# EAGLE design implant8 (EAGLE 7.6.0)
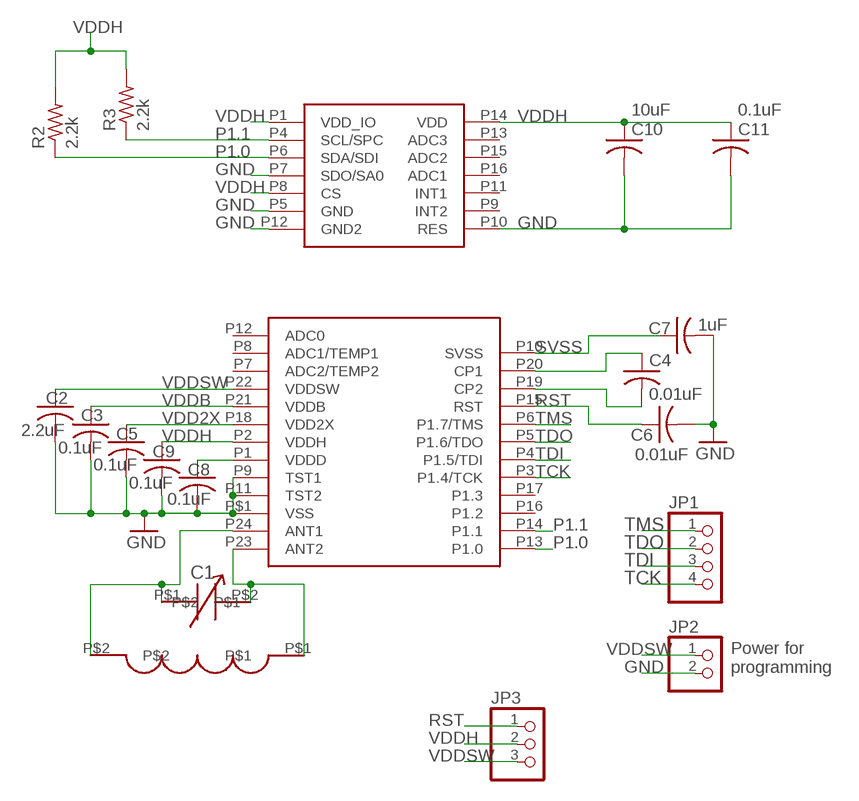
[diagram p0: schematic, sheet 1]

## Parts
C2  2.2uF  C-USC0805  [C0805]
C3  0.1uF  C-USC0805  [C0805]
C4  0.01uF  C-USC0805  [C0805]
C5  0.1uF  C-USC0805  [C0805]
C6  0.01uF  C-USC0805  [C0805]
C7  1uF  C-USC0805  [C0805]
C8  0.1uF  C-USC0805  [C0805]
C9  0.1uF  C-USC0805  [C0805]
C10  10uF  C-USC0805  [C0805]
C11  0.1uF  C-USC0805  [C0805]
JP1  PINHD-1X4  [1X04]
JP2  PINHD-1X2  [1X02]
JP3  PINHD-1X3  [1X03]
R2  2.2k  R-US_R0805  [R0805]
R3  2.2k  R-US_R0805  [R0805]
U$1  RF430FRL152H  [VQFN]
U$2  COILCOIL3  [COIL3]
U$3  VAR_CAP  [VAR_CAP]
U$4  LIS3DH  [LGA-16]

## Nets
GND: C2.2 C3.2 C5.2 C6.2 C7.2 C8.2 C9.2 C10.2 C11.2 JP2.2 U$1.P9(TST1) U$1.P11(TST2) U$1.P$1(VSS) U$4.P5(GND) U$4.P7(SDO/SA0) U$4.P10(RES) U$4.P12(GND2)
N$5: C8.1 U$1.P1(VDDD)
N$7: U$1.P23(ANT2) U$2.P$1 U$3.P$2
N$8: C4.1 U$1.P20(CP1)
N$9: C4.2 U$1.P19(CP2)
N$11: U$1.P24(ANT1) U$2.P$2 U$3.P$1
P1.0: R2.1 U$1.P13(P1.0) U$4.P6(SDA/SDI)
P1.1: R3.1 U$1.P14(P1.1) U$4.P4(SCL/SPC)
RST: C6.1 JP3.1 U$1.P15(RST)
SVSS: C7.1 U$1.P10(SVSS)
TCK: JP1.4 U$1.P3(P1.4/TCK)
TDI: JP1.3 U$1.P4(P1.5/TDI)
TDO: JP1.2 U$1.P5(P1.6/TDO)
TMS: JP1.1 U$1.P6(P1.7/TMS)
VDD2X: C5.1 U$1.P18(VDD2X)
VDDB: C3.1 U$1.P21(VDDB)
VDDH: C9.1 C10.1 C11.1 JP3.2 R2.2 R3.2 U$1.P2(VDDH) U$4.P1(VDD_IO) U$4.P8(CS) U$4.P14(VDD)
VDDSW: C2.1 JP2.1 JP3.3 U$1.P22(VDDSW)
Unconnected: U$1.P7(ADC2/TEMP2) U$1.P8(ADC1/TEMP1) U$1.P12(ADC0) U$1.P16(P1.2) U$1.P17(P1.3) U$4.P9(INT2) U$4.P11(INT1) U$4.P13(ADC3) U$4.P15(ADC2) U$4.P16(ADC1)

## Notes on the sheet
- C1
- Power for 
  programming

## Library data of the parts
C2-C11 = rcl:C-US: CAPACITOR, American symbol
JP1 = pinhead:PINHD-1X4: PIN HEADER
JP2 = pinhead:PINHD-1X2: PIN HEADER
JP3 = pinhead:PINHD-1X3: PIN HEADER
R2 R3 = rcl:R-US_: RESISTOR, American symbol
U$1 = RF430:RF430FRL152H
U$2 = RF430:COIL
U$3 = RF430:VAR_CAP
U$4 = RF430:LIS3DH

## Board
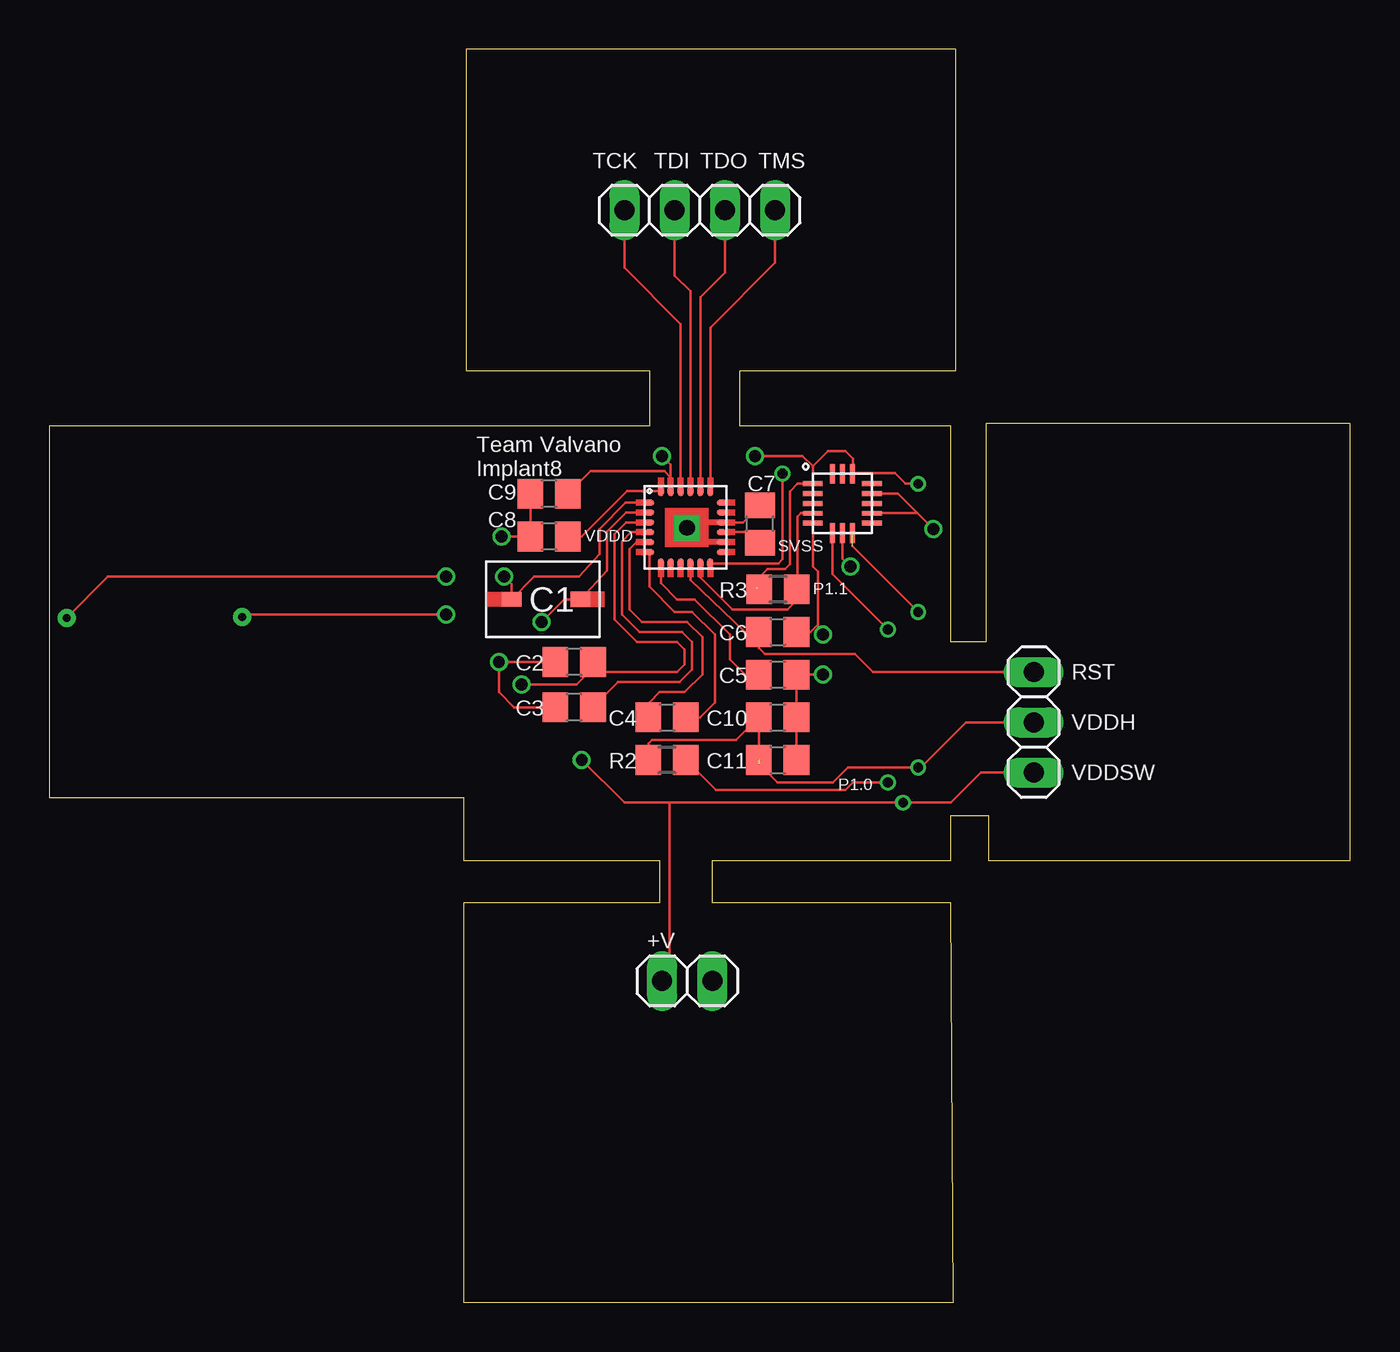
[diagram p1: board, top side]
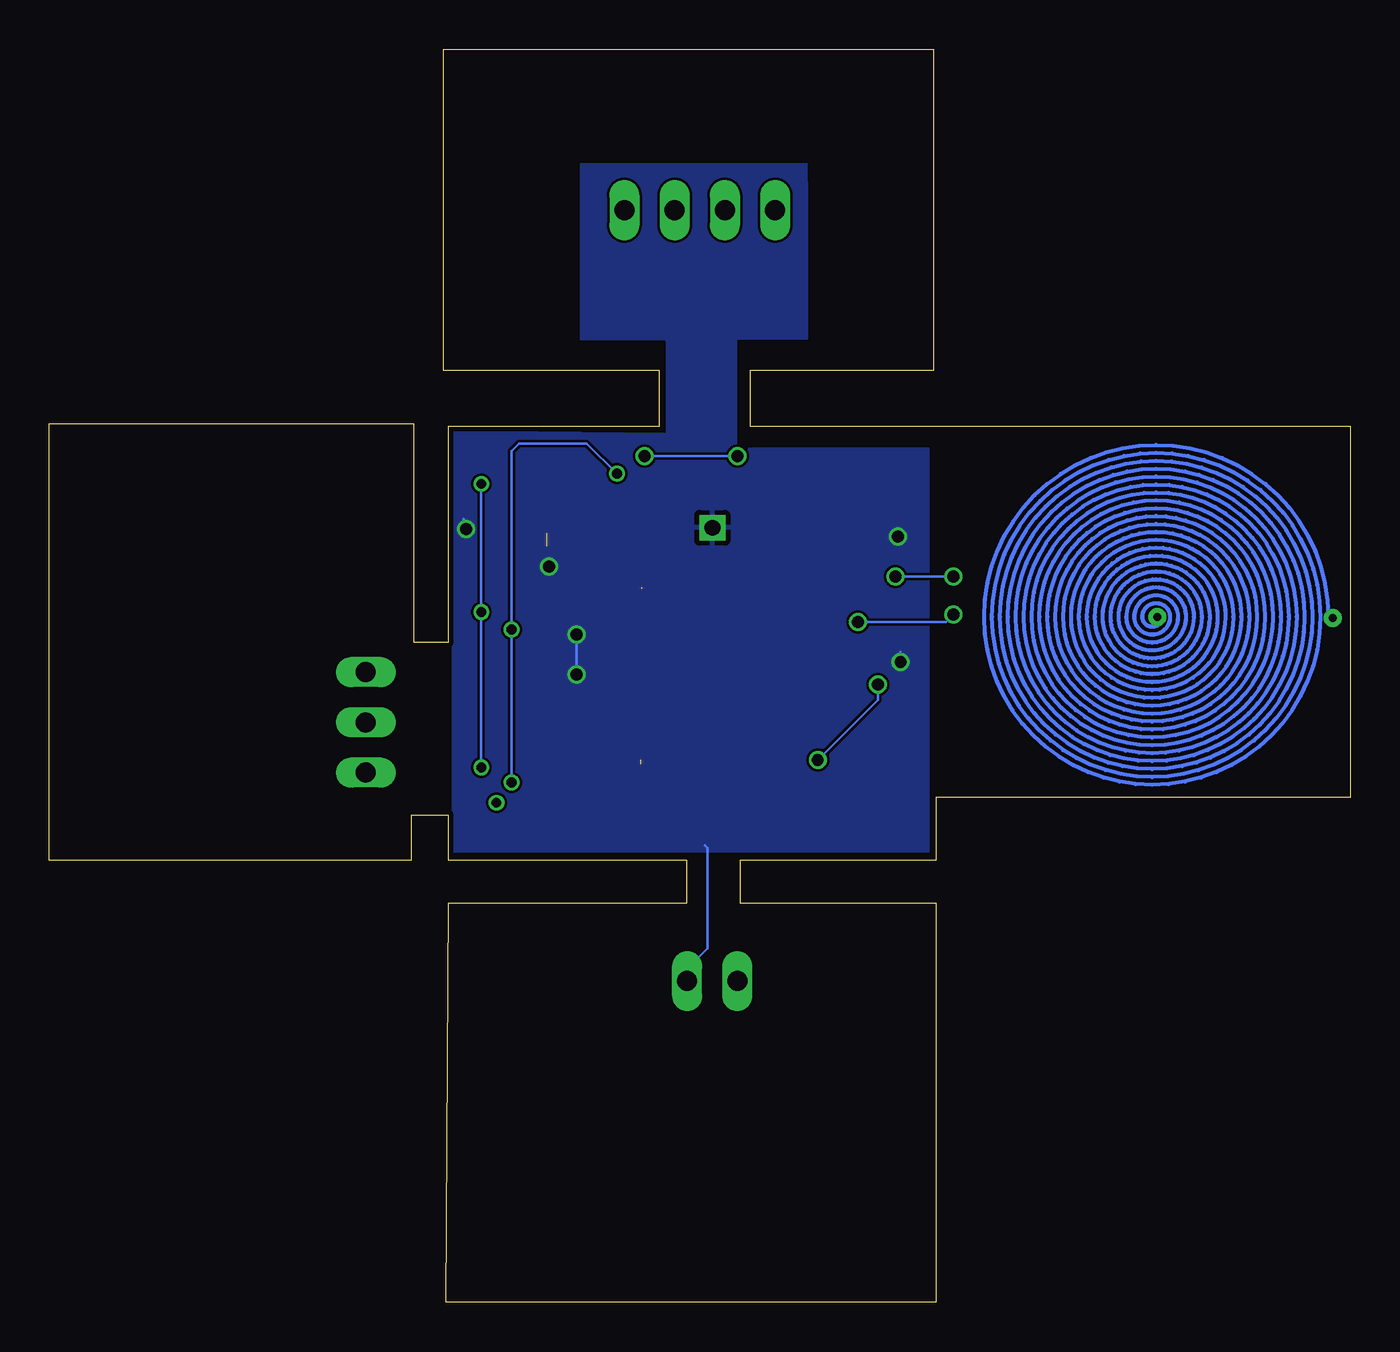
[diagram p2: board, bottom side, seen from below]

Size 65.79 x 63.37 mm. Coordinates in mm from the lower left corner, seen from the top.
Outline: 0,25.53 20.95,25.53 20.95,22.35 30.86,22.35 30.86,20.19 20.95,20.19 20.95,0 45.72,0 45.59,20.19 33.53,20.19 33.53,22.35 45.59,22.35 45.59,24.64 47.5,24.64 47.5,22.35 65.79,22.35 65.79,44.45 47.37,44.45 47.37,33.4 45.59,33.4 45.59,44.32 34.93,44.32 34.93,47.12 45.85,47.12 45.85,63.37 21.08,63.37 21.08,47.12 30.35,47.12 30.35,44.32 0,44.32 0,25.53
Copper layers (1*16): Top 0.035mm / dielectric 1.5mm / Bottom 0.035mm
Design rules "dirt_cheap_dirty_boards.v1": minimum track width 5mil, minimum drill 12mil, track to track 5mil, track to pad 5mil, pad to pad 5mil, via to via 5mil, smd to smd 0mil, copper to edge 10mil, drill to drill 10mil, minimum pad ring 10mil, minimum via ring 6mil, stop-mask expansion 2mil, vias tented up to drill 25mil, thermal gap 10mil

### Footprints (pad centres in the part's own frame; a part is rotated, then mirrored left to right if it is on the bottom)
C0805 = smd 1.3 x 1.5: 1 -0.95,0; 2 0.95,0
1X04 = drill 1.016 long: 1 -3.81,0; 2 -1.27,0; 3 1.27,0; 4 3.81,0
1X02 = drill 1.016 long: 1 -1.27,0; 2 1.27,0
1X03 = drill 1.016 long: 1 -2.54,0; 2 0,0; 3 2.54,0
R0805 = smd 1.3 x 1.5: 1 -0.95,0; 2 0.95,0
VQFN = smd 0.3 x 0.5: P1 0.825,-0.25; P2 1.325,-0.25; P3 1.825,-0.25; P4 2.325,-0.25; P5 2.825,-0.25; P6 3.325,-0.25; P13 3.325,-3.9; P14 2.825,-3.9; P15 2.325,-3.9; P16 1.825,-3.9; P17 1.325,-3.9; P18 0.825,-3.9; P26 0.825,-0.25; P34 2.824,-3.901; P35 2.324,-3.901; P36 3.324,-3.901; P37 1.824,-3.901; P38 1.324,-3.901; P39 0.824,-3.901; P40 3.324,-3.901 | smd 0.5 x 0.3: P7 3.9,-0.825; P8 3.9,-1.325; P9 3.9,-1.825; P10 3.9,-2.325; P11 3.9,-2.825; P12 3.9,-3.325; P19 0.25,-3.325; P20 0.25,-2.825; P21 0.25,-2.325; P22 0.25,-1.825; P23 0.25,-1.325; P24 0.25,-0.825; P27 3.906,-1.325; P28 3.906,-1.825; P29 3.906,-0.825; P30 3.906,-2.325; P31 3.906,-2.825; P32 3.906,-3.325; P33 3.906,-0.825; P41 0.25,-2.825; P42 0.25,-2.325; P43 0.25,-3.325; P44 0.25,-1.825; P46 0.25,-0.825; P47 0.25,-3.325 | drill 0.8 square: P$1 2.153,-2.097
COIL3 = drill 0.4 pad 0.6: P$1 0.151,-0.003; P$2 9.039,-0.051
VAR_CAP = smd 1 x 0.75: P$1 0,0 | smd 1 x 0.8: P$2 3.5,0
LGA-16 = smd 1 x 0.25: P1 0,-0.5; P2 0,-1; P3 0,-1.5; P4 0,-2; P5 0,-2.5; P9 3,-2.5; P10 3,-2; P11 3,-1.5; P12 3,-1; P13 3,-0.5 | smd 0.25 x 1: P6 1,-3; P7 1.5,-3; P8 2,-3; P14 2,0; P15 1.5,0; P16 1,0

### Placement (x,y rotation side)
C2  26.54,32.38 180 top
C3  26.54,30.1 180 top
C4  31.24,29.59 0 top
C5  36.83,31.75 0 top
C6  36.83,33.91 0 top
C7  35.94,39.37 90 top
C8  25.27,38.73 180 top
C9  25.27,40.89 180 top
C10  36.83,29.59 0 top
C11  36.83,27.43 0 top
JP1  32.89,55.25 180 top
JP2  32.26,16.26 0 top
JP3  49.78,29.34 270 top
R2  31.24,27.43 180 top
R3  36.85,36.07 180 top
U$1  30.1,41.27 0 top
U$2  9.91,34.67 0 bottom
U$3  23.37,35.56 0 top
U$4  38.61,41.91 0 top

### Tracks (layer width: path | path; a pad name or v marks a point on that pad's centre or on a via)
GND  (via drill 0.6)
  Top 0.127: C9.2 C8.2 v22.86,38.73 | U$1.P9 35.07,39.45 C7.2 | C11.2 C10.2 C5.2 v39.12,31.75 | U$4.P5 38.61,37.21 38.86,36.96 38.86,34.29 | 38.86,34.29 38.48,33.91 C6.2 | C2.2 v22.73,32.38 22.73,30.86 23.5,30.1 C3.2 | U$4.P12 42.91,40.91 43.91,39.91 | 43.91,39.91 v44.7,39.12 | U$4.P10 43.91,39.91 | U$4.P7 40.11,37.62 v40.51,37.21 | 38.86,34.29 38.86,34.04 v39.12,33.78
  Top 0.305: U$1.P9 32.52,39.45 U$1.P$1 32.98,38.45 U$1.P11
  Bottom 0.127: v39.12,31.75 v39.12,33.78 | v22.86,38.73 22.73,38.73 | v22.73,32.38 22.73,32.89 | JP2.2 33.53,16.89 32.51,17.91 32.51,22.99 32.64,23.11 | v40.51,37.21 40.64,37.08 | v44.7,39.12 44.7,39.5 44.83,39.62 44.83,39.24 v44.7,39.12
  pour Bottom: 27.47,56.65 27.47,48.74 31.05,48.72 31.05,43.16 30.19,43.19 21.33,43.19 21.33,22.81 45.36,22.81 45.36,28.25 45.36,28.25 45.36,36.41 45.35,36.41 45.35,43.72 45.34,43.72 45.34,44.04 34.55,43.91 34.55,48.71 38.89,48.71 38.89,57.56 27.49,57.56 27.49,56.55
N$5
  Top 0.127: U$1.P1 29.21,41.02 26.92,38.73 C8.1
N$7  (via drill 0.6)
  Top 0.127: U$1.P23 29.15,39.95 28.19,38.99 28.19,37.01 U$3.P$2 26.04,35.56 v24.89,34.42 | v20.07,34.8 9.89,34.8 U$2.P$1
  Bottom 0.127: v24.89,34.42 20.45,34.42 v20.07,34.8
N$8
  Top 0.127: U$1.P20 29.69,38.45 29.34,38.1 29.34,35.05 29.97,34.42 32.26,34.42 33.02,33.66 33.02,31.75 32.13,30.86 30.86,30.86 30.35,30.35 30.35,29.65 C4.1
N$9
  Top 0.127: U$1.P19 30.35,36.2 31.62,34.92 32.51,34.92 33.66,33.78 33.66,30.35 32.89,29.59 C4.2
N$11  (via drill 0.6)
  Top 0.127: U$1.P24 29.15,40.45 27.81,39.12 27.81,37.85 26.8,36.7 24.51,36.7 U$3.P$1 23.37,36.32 v22.99,36.7 | v20.07,36.7 2.95,36.7 U$2.P$2
  Bottom 0.127: v22.99,36.7 v20.07,36.7
P1.0  (via drill 0.5 pad 0.3)
  Top 0.127: U$1.P13 36.87,37.38 37.08,37.59 v37.08,41.91 | U$4.P6 39.61,36.85 v42.42,34.04 | v42.42,26.29 40.64,26.29 40.26,25.91 33.72,25.91 R2.1
  Bottom 0.127: v42.42,26.29 v42.42,34.04 42.42,43.05 42.04,43.43 38.61,43.43 v37.08,41.91
P1.1
  Top 0.127: U$4.P4 38.01,39.91 37.85,39.75 37.85,36.11 R3.1 37.72,35.99 37.72,35.43 37.34,35.05 34.54,35.05 32.92,36.67 U$1.P14
RST
  Top 0.127: U$1.P15 32.42,36.54 35.18,33.91 C6.1 35.88,33.1 36.18,32.8 40.73,32.8 41.66,31.88 JP3.1
SVSS
  Top 0.127: U$1.P10 35.41,38.95 C7.1
TCK
  Top 0.127: U$1.P3 31.92,49.48 29.08,52.32 JP1.4
TDI
  Top 0.127: U$1.P4 32.42,51.14 31.62,51.94 JP1.3
TDO
  Top 0.127: U$1.P5 32.92,50.83 34.16,52.07 JP1.2
TMS
  Top 0.127: U$1.P6 33.42,49.3 36.7,52.58 JP1.1
VDD2X
  Top 0.127: U$1.P18 30.92,36.39 31.75,35.56 32.64,35.56 34.42,33.78 34.42,32.51 35.18,31.75 C5.1
VDDB
  Top 0.127: U$1.P21 29.43,38.95 28.96,38.48 28.96,34.8 29.85,33.91 32,33.91 32.51,33.4 32.51,32 31.88,31.37 28.76,31.37 C3.1
VDDH  (via drill 0.5 pad 0.3, 0.6)  (3 unrouted)
  Top 0.127: C9.1 27.37,42.04 31.11,42.04 31.42,41.73 U$1.P2 31.42,42.36 v30.99,42.8 | 35.81,36.11 R3.2 | 35.81,36.16 35.81,36.58 36.32,37.08 37.21,37.08 37.47,37.34 37.47,41.02 37.85,41.4 38.6,41.4 U$4.P1 38.61,42.29 | C11.1 C10.1 34.74,28.45 30.48,28.45 30.29,28.26 R2.2 | v43.94,41.4 43.31,41.4 42.77,41.94 40.64,41.94 | 40.61,38.26 v43.94,34.92 | 35.88,27.24 36.83,26.29 39.62,26.29 40.39,27.05 v43.94,27.05 44.07,27.05 46.36,29.34 JP3.2 | v35.69,42.8 38.1,42.8 38.61,42.29 | 38.61,42.29 39.37,43.05 40.26,43.05 40.64,42.67 40.64,41.94 | 40.64,41.94 U$4.P14
  Bottom 0.127: v43.94,41.4 v43.94,34.92 v43.94,27.05 | v30.99,42.8 v35.69,42.8
VDDSW  (via drill 0.5 pad 0.3, 0.6)
  Top 0.127: U$1.P22 29.16,39.45 28.57,38.86 28.57,34.54 29.72,33.4 31.75,33.4 32.13,33.02 32.13,32.26 31.75,31.88 28.07,31.88 28.07,32 27.69,32.38 C2.1 27.49,32.06 26.67,31.24 v23.88,31.24 | JP2.1 31.37,16.51 31.37,25.27 | 31.37,25.27 v43.18,25.27 45.59,25.27 47.12,26.8 JP3.3 | v26.92,27.43 29.08,25.27 31.37,25.27
  Bottom 0.127: v23.88,31.24 23.88,30.48 v26.92,27.43
(copper drawn outside any net)
  shapes: Top area x2

### Text on the board
tPlace: TCK | TDI | TDO | TMS | Team Valvano / Implant8 | C1 | +V
tNames: VDDD | SVSS | P1.1 | RST | VDDH | VDDSW | P1.0